# EAGLE design LEDControllerBoard (EAGLE 6.4)
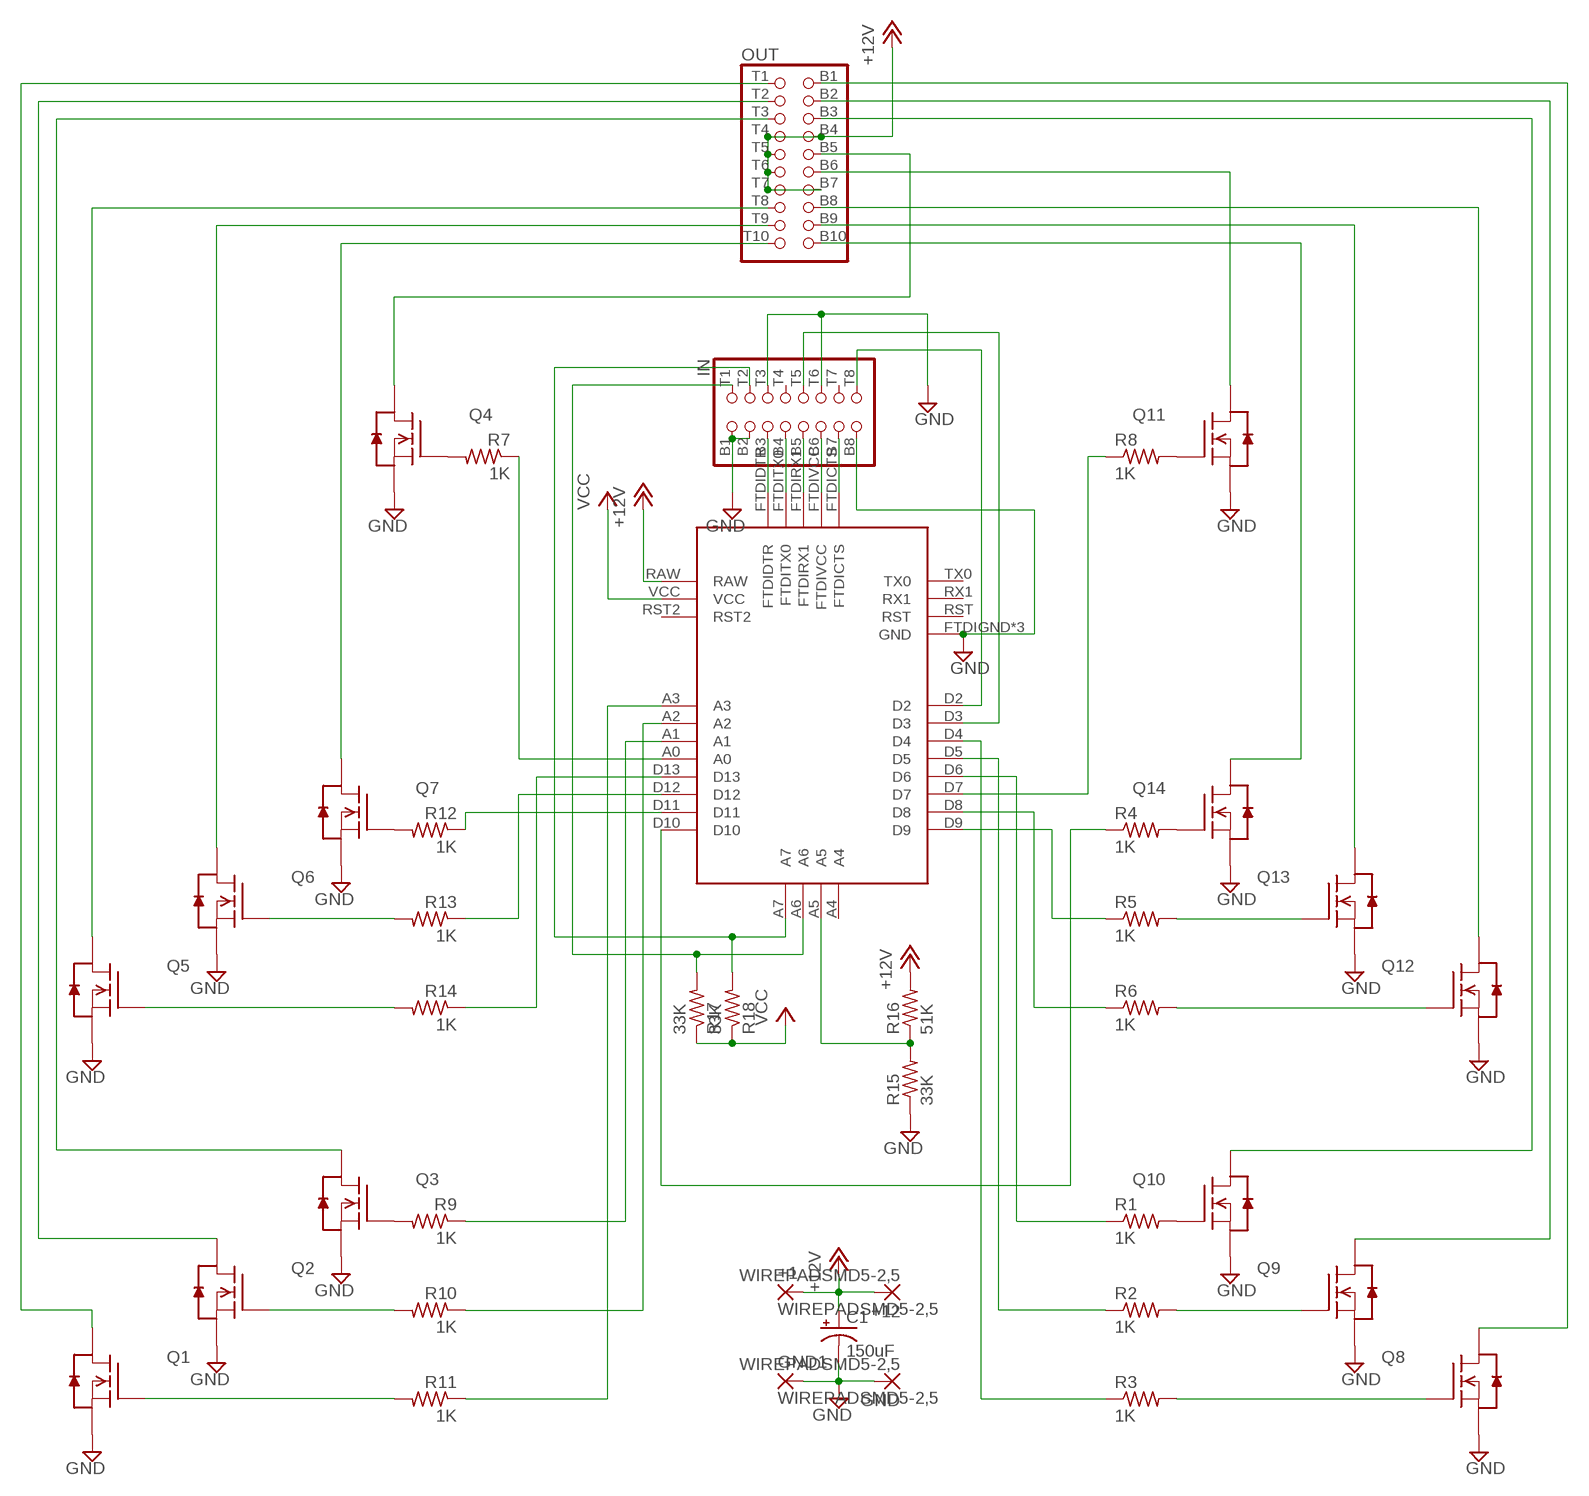
[diagram p0: schematic, sheet 1]

## Parts
+1  WIREPADSMD5-2,5  [5-2,5]
+12  WIREPADSMD5-2,5  [5-2,5]
C1  150uF  CPOL-USD  [PANASONIC_D]
GND  WIREPADSMD5-2,5  [5-2,5]
GND1  WIREPADSMD5-2,5  [5-2,5]
IN  PINHD-2X8/EDGE  [2X8/EDGE]
OUT  PINHD-2X10/EDGE  [2X10/EDGE]
Q1  FDC653NSSOT6  [SSOT6]
Q2  FDC653NSSOT6  [SSOT6]
Q3  FDC653NSSOT6  [SSOT6]
Q4  FDC653NSSOT6  [SSOT6]
Q5  FDC653NSSOT6  [SSOT6]
Q6  FDC653NSSOT6  [SSOT6]
Q7  FDC653NSSOT6  [SSOT6]
Q8  FDC653NSSOT6  [SSOT6]
Q9  FDC653NSSOT6  [SSOT6]
Q10  FDC653NSSOT6  [SSOT6]
Q11  FDC653NSSOT6  [SSOT6]
Q12  FDC653NSSOT6  [SSOT6]
Q13  FDC653NSSOT6  [SSOT6]
Q14  FDC653NSSOT6  [SSOT6]
R1  1K  R-US_R0603  [R0603]
R2  1K  R-US_R0603  [R0603]
R3  1K  R-US_R0603  [R0603]
R4  1K  R-US_R0603  [R0603]
R5  1K  R-US_R0603  [R0603]
R6  1K  R-US_R0603  [R0603]
R7  1K  R-US_R0603  [R0603]
R8  1K  R-US_R0603  [R0603]
R9  1K  R-US_R0603  [R0603]
R10  1K  R-US_R0603  [R0603]
R11  1K  R-US_R0603  [R0603]
R12  1K  R-US_R0603  [R0603]
R13  1K  R-US_R0603  [R0603]
R14  1K  R-US_R0603  [R0603]
R15  33K  R-US_R0603  [R0603]
R16  51K  R-US_R0603  [R0603]
R17  33K  R-US_R0603  [R0603]
R18  33K  R-US_R0603  [R0603]
U$15  ARDUINOPROMINI  [ARDUINOPROMINI]

## Nets
+12V: +1.1(P) +12.1(P) C1.+ OUT.B4 OUT.B7 OUT.T4 OUT.T5 OUT.T6 OUT.T7 R16.2 U$15.RAW
GND: C1.- GND1.1(P) GND.1(P) IN.B1 IN.B2 IN.B8 IN.T3 IN.T6 Q1.4(S) Q2.4(S) Q3.4(S) Q4.4(S) Q5.4(S) Q6.4(S) Q7.4(S) Q8.4(S) Q9.4(S) Q10.4(S) Q11.4(S) Q12.4(S) Q13.4(S) Q14.4(S) R15.1 U$15.FTDIGND(GND) U$15.GND U$15.GND2(GND)
N$1: Q10.3(G) R1.2
N$2: Q9.3(G) R2.2
N$3: OUT.B5 Q4.1(D) Q4.2(D) Q4.5(D) Q4.6(D)
N$4: OUT.B10 Q14.1(D) Q14.2(D) Q14.5(D) Q14.6(D)
N$5: Q8.3(G) R3.2
N$6: OUT.B9 Q13.1(D) Q13.2(D) Q13.5(D) Q13.6(D)
N$7: Q14.3(G) R4.2
N$8: Q13.3(G) R5.2
N$9: OUT.B8 Q12.1(D) Q12.2(D) Q12.5(D) Q12.6(D)
N$10: OUT.B3 Q10.1(D) Q10.2(D) Q10.5(D) Q10.6(D)
N$11: OUT.B2 Q9.1(D) Q9.2(D) Q9.5(D) Q9.6(D)
N$12: Q12.3(G) R6.2
N$13: OUT.B1 Q8.1(D) Q8.2(D) Q8.5(D) Q8.6(D)
N$14: OUT.B6 Q11.1(D) Q11.2(D) Q11.5(D) Q11.6(D)
N$15: R10.1 U$15.A2
N$16: OUT.T10 Q7.1(D) Q7.2(D) Q7.5(D) Q7.6(D)
N$17: OUT.T9 Q6.1(D) Q6.2(D) Q6.5(D) Q6.6(D)
N$18: Q3.3(G) R9.2
N$19: Q4.3(G) R7.2
N$20: Q11.3(G) R8.2
N$21: Q2.3(G) R10.2
N$22: OUT.T8 Q5.1(D) Q5.2(D) Q5.5(D) Q5.6(D)
N$23: OUT.T3 Q3.1(D) Q3.2(D) Q3.5(D) Q3.6(D)
N$24: Q1.3(G) R11.2
N$25: OUT.T2 Q2.1(D) Q2.2(D) Q2.5(D) Q2.6(D)
N$26: Q7.3(G) R12.2
N$27: Q6.3(G) R13.2
N$28: OUT.T1 Q1.1(D) Q1.2(D) Q1.5(D) Q1.6(D)
N$29: IN.B7 U$15.FTDICTS
N$30: Q5.3(G) R14.2
N$31: IN.B6 U$15.FTDIVCC
N$32: IN.B5 U$15.FTDIRX1
N$33: R3.1 U$15.D4
N$34: R2.1 U$15.D5
N$35: R1.1 U$15.D6
N$36: R6.1 U$15.D8
N$37: R5.1 U$15.D9
N$38: R4.1 U$15.D10
N$39: R7.1 U$15.A0
N$40: R8.1 U$15.D7
N$41: R15.2 R16.1 U$15.A5
N$42: IN.T5 U$15.D3
N$43: R9.1 U$15.A1
N$44: R11.1 U$15.A3
N$45: R12.1 U$15.D11
N$46: R14.1 U$15.D13
N$47: R13.1 U$15.D12
N$48: IN.T2 R18.2 U$15.A7
N$49: IN.T8 U$15.D2
N$50: IN.B4 U$15.FTDITX0
N$51: IN.B3 U$15.FTDIDTR
N$53: IN.T1 R17.2 U$15.A6
VCC: R17.1 R18.1 U$15.VCC
Unconnected: IN.T4 IN.T7 U$15.A4 U$15.RST U$15.RST2 U$15.RX1 U$15.TX0

## Library data of the parts
+1 +12 GND GND1 = wirepad:WIREPAD: Wire PAD connect wire on PCB
C1 = rcl:CPOL-US: POLARIZED CAPACITOR, American symbol
IN = clough:PINHD-2X8: PIN HEADER
OUT = clough:PINHD-2X10: PIN HEADER
Q1-Q14 = clough:FDC653N: Fairchild FDC653N N-Channel Enhancement Mode Field Effect Transistor
R1-R18 = resistor:R-US_: RESISTOR, American symbol
U$15 = clough:ARDUINOPROMINI: Arduino Pro Mini to be placed and soldered down as a daughter board.

## Net classes
1 +15V: width 0.61 mm, clearance 0.406 mm

## Board
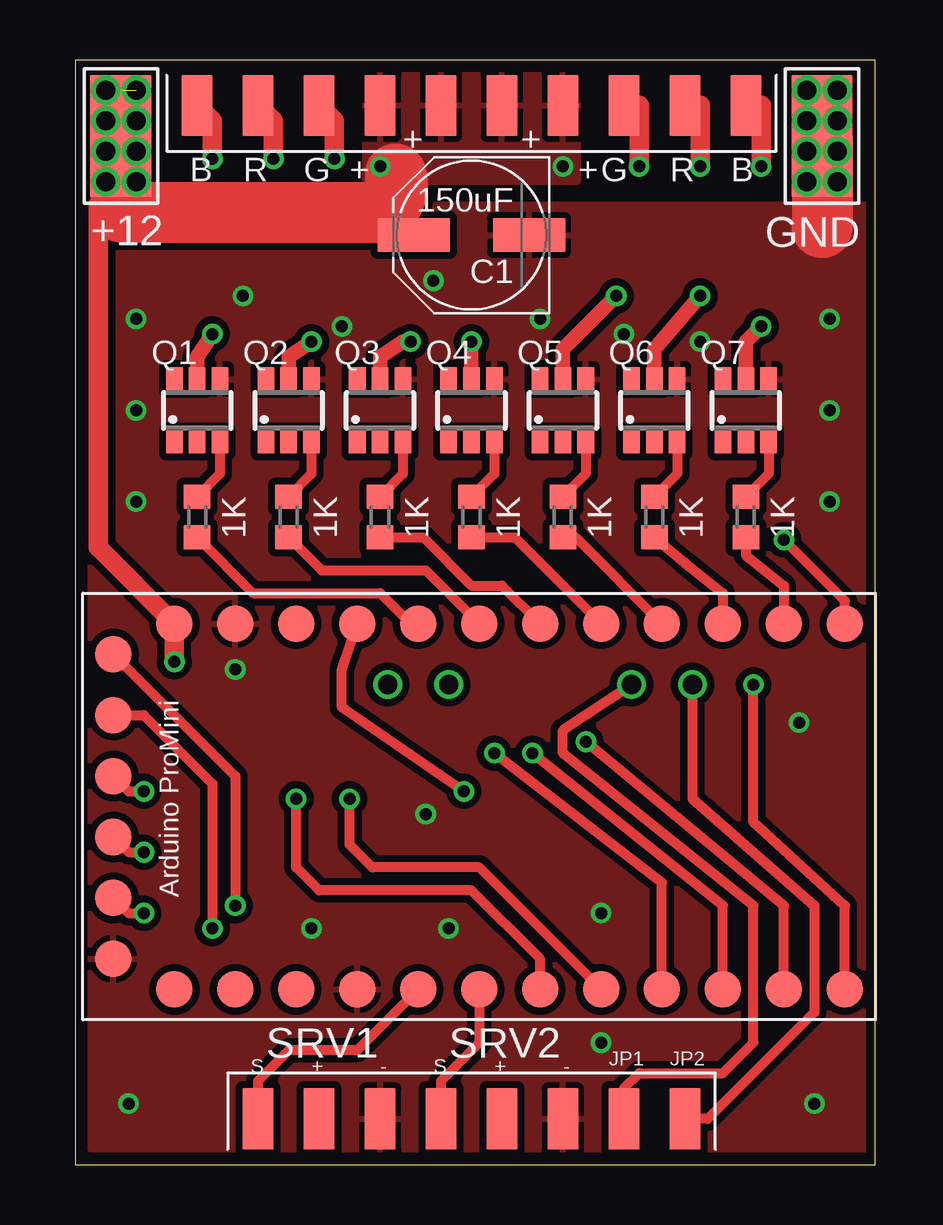
[diagram p1: board, top side]
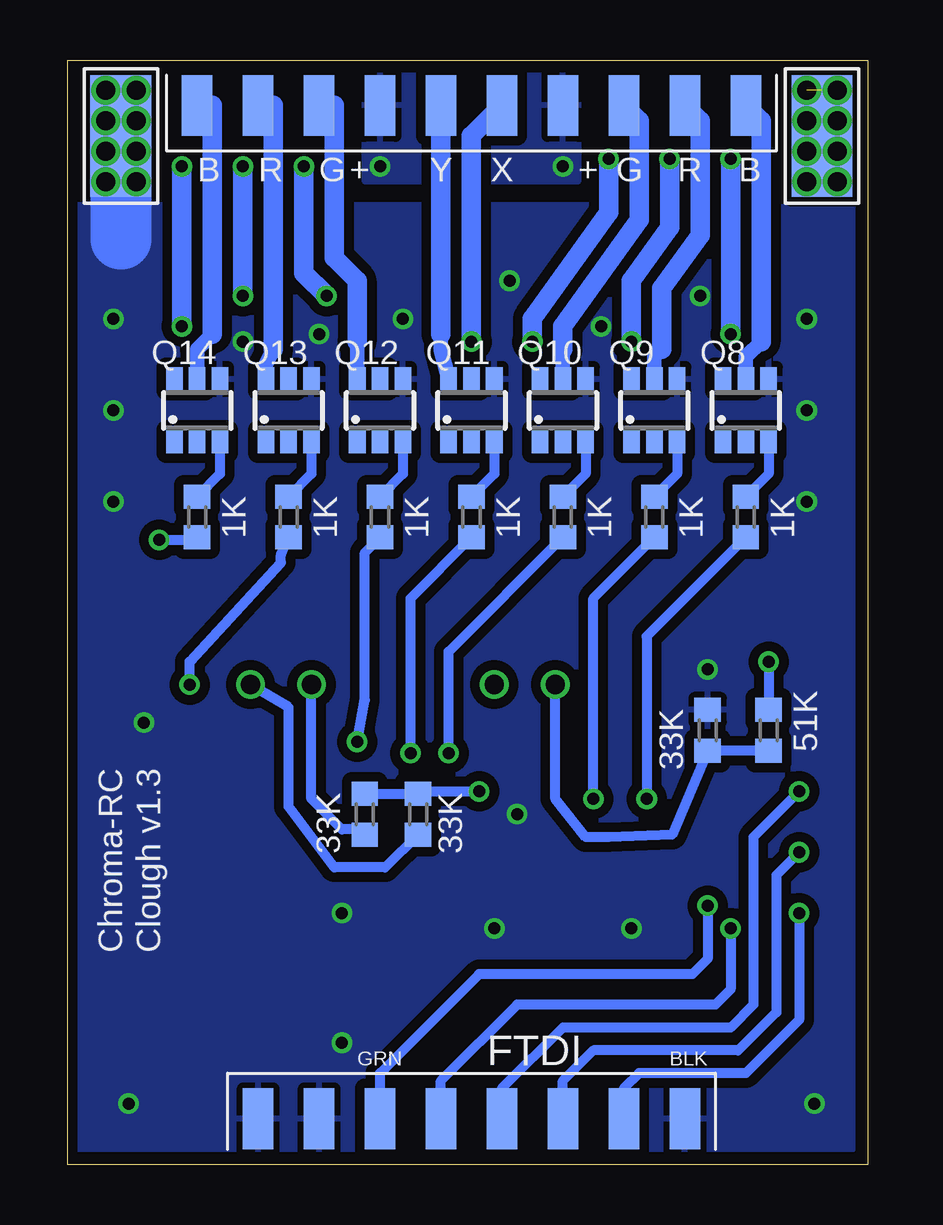
[diagram p2: board, bottom side, seen from below]

Size 33.32 x 46.03 mm. Coordinates in mm from the lower left corner, seen from the top.
Outline: 0,0 33.32,0 33.32,46.03 0,46.03 0,0
Copper layers (1*16): Top 0.0356mm / dielectric 1.5011mm / Bottom 0.0356mm
Design rules "LaenPCBOrder": minimum track width 6mil, minimum drill 13mil, track to track 6mil, track to pad 6mil, pad to pad 6mil, via to via 6mil, smd to smd 6mil, copper to edge 15mil, drill to drill 6mil, minimum pad ring 7mil, minimum via ring 7mil, stop-mask expansion 3mil, vias tented up to drill 0mil, thermal gap 10mil

### Footprints (pad centres in the part's own frame; a part is rotated, then mirrored left to right if it is on the bottom)
5-2,5 = smd 2.54 x 5.08: 1 0,0
PANASONIC_D = smd 3 x 1.4: + 2.4,0; - -2.4,0
2X8/EDGE = smd 1.27 x 2.54 bottom: B1 -8.89,0; B2 -6.35,0; B3 -3.81,0; B4 -1.27,0; B5 1.27,0; B6 3.81,0; B7 6.35,0; B8 8.89,0 | smd 1.27 x 2.54: T1 -8.89,0; T2 -6.35,0; T3 -3.81,0; T4 -1.27,0; T5 1.27,0; T6 3.81,0; T7 6.35,0; T8 8.89,0
2X10/EDGE = smd 1.27 x 2.54 bottom: B1 -11.43,0; B2 -8.89,0; B3 -6.35,0; B4 -3.81,0; B5 -1.27,0; B6 1.27,0; B7 3.81,0; B8 6.35,0; B9 8.89,0; B10 11.43,0 | smd 1.27 x 2.54: T1 -11.43,0; T2 -8.89,0; T3 -6.35,0; T4 -3.81,0; T5 -1.27,0; T6 1.27,0; T7 3.81,0; T8 6.35,0; T9 8.89,0; T10 11.43,0
SSOT6 = smd 0.69 x 0.99: 1 -0.95,-1.3; 2 0,-1.3; 3 0.95,-1.3; 4 0.95,1.3; 5 0,1.3; 6 -0.95,1.3
R0603 = smd 1 x 1.1: 1 -0.85,0; 2 0.85,0
ARDUINOPROMINI = smd 1.524 x 1.524: A0 7.62,-5.08; A1 7.62,-2.54; A2 7.62,0; A3 7.62,2.54; D2 -7.62,2.54; D3 -7.62,0; D4 -7.62,-2.54; D5 -7.62,-5.08; D6 -7.62,-7.62; D7 -7.62,-10.16; D8 -7.62,-12.7; D9 -7.62,-15.24; D10 7.62,-15.24; D11 7.62,-12.7; D12 7.62,-10.16; D13 7.62,-7.62; FTDICTS -3.81,15.24; FTDIDTR 6.35,15.24; FTDIGND -6.35,15.24; FTDIRX1 1.27,15.24; FTDITX0 3.81,15.24; FTDIVCC -1.27,15.24; GND -7.62,5.08; GND2 7.62,10.16; RAW 7.62,12.7; RST -7.62,7.62; RST2 7.62,7.62; RX1 -7.62,10.16; TX0 -7.62,12.7; VCC 7.62,5.08 | drill 0.8: A4 5.08,1.27; A5 5.08,3.81; A6 5.08,-8.89; A7 5.08,-6.35

### Placement (x,y rotation side)
+1  1.9,42.86 0 bottom
+12  1.9,42.86 180 top
C1  16.51,38.73 180 top
GND  31.11,42.86 180 top
GND1  31.11,42.86 180 bottom
IN  16.51,1.9 180 top
OUT  16.51,44.13 0 top
Q1  5.08,31.43 0 top
Q2  8.89,31.43 0 top
Q3  12.7,31.43 0 top
Q4  16.51,31.43 0 top
Q5  20.32,31.43 0 top
Q6  24.13,31.43 0 top
Q7  27.94,31.43 0 top
Q8  5.08,31.43 0 bottom
Q9  8.89,31.43 0 bottom
Q10  12.7,31.43 0 bottom
Q11  16.51,31.43 0 bottom
Q12  20.32,31.43 0 bottom
Q13  24.13,31.43 0 bottom
Q14  27.94,31.43 0 bottom
R1  12.7,26.99 90 bottom
R2  8.89,26.99 90 bottom
R3  5.08,26.99 90 bottom
R4  27.94,26.99 90 bottom
R5  24.13,26.99 90 bottom
R6  20.32,26.99 90 bottom
R7  16.51,26.99 90 top
R8  16.51,26.99 90 bottom
R9  12.7,26.99 90 top
R10  8.89,26.99 90 top
R11  5.08,26.99 90 top
R12  27.94,26.99 90 top
R13  24.13,26.99 90 top
R14  20.32,26.99 90 top
R15  6.67,18.1 270 bottom
R16  4.13,18.1 90 bottom
R17  18.73,14.61 270 bottom
R18  20.96,14.61 270 bottom
U$15  16.83,14.92 90 top

### Tracks (layer width: path | path; a pad name or v marks a point on that pad's centre or on a via)
+12V  (via drill 0.5, 0.8)  (1 unrouted)
  Top 0.406: +1.1 1.27,42.86 v1.27,43.5 v1.27,44.77 | v2.54,44.77 v2.54,43.5 v2.54,42.23 | v2.54,42.23 v2.54,40.96 | v2.54,42.23 v1.27,42.23 v1.27,40.96
  Top 0.813: 1.9,39.69 0.95,40.01 0.95,25.72 U$15.RAW v4.13,20.95
  Top 1.27: C1.+ 13.97,38.73 12.7,39.69
  Top 2.54: +1.1 1.9,39.69 12.7,39.69 arc90 13.34,41.28 13.34,40.96
  Bottom 0.406: v4.13,20.95 R16.2 | v1.27,44.77 1.9,44.77 +1.1
  other vias: 12.7,41.59 20.32,41.59
  pour Bottom (isolate 0.406): 12.07,45.4 12.07,40.96 20.96,40.96 20.96,45.4
  pour Top: 12.07,45.4 12.07,40.96 20.96,40.96 20.96,45.4
GND  (via drill 0.5, 0.8)
  Top 0.406: v30.48,44.77 31.11,44.77 GND1.1 | 31.75,42.86 30.48,42.86 v30.48,42.23 | 31.75,42.86 v31.75,42.23 v31.75,40.96 | v31.75,40.96 31.75,40.32 | v31.75,44.77 v30.48,44.77 | v31.75,43.5 31.75,42.86 | v31.75,40.96 v30.48,40.96 v30.48,42.23 | v30.48,42.23 v30.48,44.77
  Top 2.54: GND1.1 31.11,39.05
  Bottom 0.406: GND1.1 30.48,42.86 v30.48,43.5 v30.48,44.77
  Bottom 2.54: GND1.1 31.11,38.58
  other vias: 2.54,35.24 2.54,31.43 2.54,27.62 31.43,35.24 31.43,31.43 31.43,27.62 6.67,20.64 14.61,14.61 21.91,10.48 30.16,18.41 2.22,2.54 9.84,9.84 15.56,9.84 21.91,5.08 11.11,34.93 14.92,36.83 19.37,35.24 30.8,2.54 6.99,36.2 26.04,34.29 22.86,34.61
  pour Top (isolate 0.305): 33.02,40.01 0.64,40.01 0.64,0.63 33.02,0.63
  pour Bottom (isolate 0.406): 33.02,40.01 0.64,40.01 0.64,0.63 33.02,0.63
N$1
  Bottom 0.406: Q10.3 11.75,28.79 R1.2
N$2
  Bottom 0.406: Q9.3 7.94,28.79 R2.2
N$3  (via drill 0.5)
  Top 0.61: v16.51,34.29 Q4.5
  Bottom 0.813: OUT.B5 16.51,42.86 v16.51,34.29
N$4
  Bottom 0.61: 27.3,34.61 27.94,33.97 Q14.5
  Bottom 0.813: OUT.B10 27.3,44.13 27.3,34.61
N$5
  Bottom 0.406: Q8.3 4.13,28.79 R3.2
N$6
  Bottom 0.61: 24.77,33.97 25.08,33.34 Q13.6
  Bottom 0.813: OUT.B9 24.77,44.13 24.77,33.97
N$7
  Bottom 0.406: Q14.3 26.99,28.79 R4.2
N$8
  Bottom 0.406: Q13.3 23.18,28.79 R5.2
N$9
  Bottom 0.61: 21.27,34.96 21.27,34.29 Q12.6
  Bottom 0.813: OUT.B8 22.23,44.13 22.23,37.78 21.27,36.83 21.27,34.29
N$10
  Bottom 0.61: 12.7,33.97 Q10.5
  Bottom 0.813: OUT.B3 9.53,43.5 9.53,39.37 12.7,34.93 12.7,33.97
N$11
  Bottom 0.61: Q9.5 8.89,33.65 8.57,33.97
  Bottom 0.813: OUT.B2 6.99,43.5 6.99,38.73 8.57,36.51 8.57,33.97
N$12
  Bottom 0.406: Q12.3 19.37,28.79 R6.2
N$13
  Bottom 0.61: 4.45,34.29 5.08,33.65 Q8.5
  Bottom 0.813: OUT.B1 4.45,43.5 4.45,34.29
N$14
  Bottom 0.61: 17.78,34.61 17.78,33.97 Q11.6
  Bottom 0.813: OUT.B6 17.78,34.61
N$15
  Top 0.406: R10.1 10.26,24.76 14.61,24.76 U$15.A2
N$16  (via drill 0.5)
  Top 0.61: v28.57,34.93 27.94,34.29 Q7.5
  Top 0.813: OUT.T10 28.57,44.13 v28.57,41.59
  Bottom 0.813: v28.57,41.59 v28.57,34.93
N$17  (via drill 0.5)
  Top 0.61: v26.04,36.19 24.13,33.97 Q6.5
  Top 0.813: OUT.T9 26.04,44.13 v26.04,41.59
  Bottom 0.813: v26.04,41.59 v26.04,36.19
N$18
  Top 0.406: Q3.3 13.65,28.79 R9.2
N$19
  Top 0.406: Q4.3 17.46,28.79 R7.2
N$20
  Bottom 0.406: Q11.3 15.56,28.79 R8.2
N$21
  Top 0.406: Q2.3 9.84,28.79 R10.2
N$22  (via drill 0.5)
  Top 0.61: v22.54,36.19 20.32,33.97 Q5.5
  Top 0.813: v23.5,41.59 23.5,44.13 OUT.T8
  Bottom 0.813: v23.5,41.59 23.5,37.15 v22.54,36.19
N$23  (via drill 0.5)
  Top 0.61: v13.97,34.29 13.65,34.29 12.7,33.65 Q3.5
  Top 0.813: OUT.T3 10.79,43.5 v10.79,41.91
  Bottom 0.813: v10.79,41.91 10.79,39.69 13.97,35.24 v13.97,34.29
N$24
  Top 0.406: Q1.3 6.03,28.79 R11.2
N$25  (via drill 0.5)
  Top 0.61: v9.84,34.29 8.89,33.65 Q2.5
  Top 0.813: OUT.T2 8.26,43.5 v8.26,41.91
  Bottom 0.813: v8.26,41.91 8.26,39.05 9.84,36.83 v9.84,34.29
N$26
  Top 0.406: Q7.3 28.89,28.79 R12.2
N$27
  Top 0.406: Q6.3 25.08,28.79 R13.2
N$28  (via drill 0.5)
  Top 0.61: v5.71,34.61 5.08,33.65 Q1.5
  Top 0.813: OUT.T1 5.71,43.5 v5.71,41.91
  Bottom 0.813: v5.71,41.91 v5.71,34.61
N$29  (via drill 0.5)
  Top 0.406: U$15.FTDICTS 2.22,10.48 v2.86,10.48
  Bottom 0.406: v2.86,10.48 2.86,6.03 5.08,3.81 9.53,3.81 10.16,3.18 IN.B7
N$30
  Top 0.406: Q5.3 21.27,28.79 R14.2
N$31  (via drill 0.5)
  Top 0.406: U$15.FTDIVCC 2.22,13.02 v2.86,13.02
  Bottom 0.406: v2.86,13.02 3.81,12.06 3.81,6.35 5.4,4.76 11.43,4.76 12.7,3.49 IN.B6
N$32  (via drill 0.5)
  Top 0.406: U$15.FTDIRX1 2.22,15.56 v2.86,15.56
  Bottom 0.406: v2.86,15.56 4.76,13.65 4.76,6.67 5.71,5.71 12.7,5.71 15.24,3.18 IN.B5
N$33  (via drill 0.5)
  Top 0.406: U$15.D4 19.37,8.57 16.51,11.43 10.16,11.43 9.21,12.38 v9.21,15.24
  Bottom 0.406: v9.21,15.24 9.21,22.01 R3.1
N$34  (via drill 0.5)
  Top 0.406: U$15.D5 16.83,12.38 12.38,12.38 11.43,13.33 v11.43,15.24
  Bottom 0.406: v11.43,15.24 11.43,23.6 R2.1
N$35  (via drill 0.5)
  Top 0.406: U$15.D6 24.45,11.75 v17.46,17.15
  Bottom 0.406: v17.46,17.15 17.46,21.38 R1.1
N$36  (via drill 0.5 pad 0.41)
  Top 0.406: U$15.D8 29.53,10.79 v21.27,17.62
  Bottom 0.406: v21.27,17.62 20.96,19.37 20.96,25.5 R6.1
N$37  (via drill 0.5)
  Top 0.406: U$15.D9 32.07,10.79 28.26,14.29 v28.26,20
  Bottom 0.406: v28.26,20 28.26,20.95 24.45,25.08 24.45,25.4 R5.1
N$38  (via drill 0.5)
  Top 0.406: U$15.D10 32.07,23.49 v29.53,26.04
  Bottom 0.406: v29.53,26.04 28.04,26.04 R4.1
N$39
  Top 0.406: R7.1 18.31,26.14 U$15.A0
N$40  (via drill 0.5 pad 0.41)
  Top 0.406: U$15.D7 26.99,10.79 v19.05,17.15
  Bottom 0.406: v19.05,17.15 19.05,23.6 R8.1
N$41
  Bottom 0.406: R16.1 R15.2 8.15,13.76 10.79,13.65 11.75,13.65 13.02,15.24 U$15.A5
N$42
  Top 0.406: U$15.D3 16.83,5.08 15.24,3.49 IN.T5
N$43
  Top 0.406: R9.1 14.5,26.14 16.51,24.13 17.78,24.13 U$15.A1
N$44
  Top 0.406: R11.1 7.41,23.81 12.7,23.81 13.97,22.54 U$15.A3
N$45
  Top 0.406: R12.1 27.94,25.4 29.53,24.13 U$15.D11
N$46
  Top 0.406: R14.1 20.85,26.14 U$15.D13
N$47
  Top 0.406: R13.1 25.4,25.08 26.99,23.81 U$15.D12
N$48
  Top 0.406: IN.T2 22.86,3.18 23.5,3.81 26.99,3.81 28.26,5.08 28.26,10.79 20.32,17.15 20.32,18.1 U$15.A7
  Bottom 0.406: R18.2 21.17,13.97 21.91,13.97 23.18,15.24 U$15.A7
N$49
  Top 0.406: U$15.D2 11.75,4.76 8.89,4.76 7.62,3.49 IN.T8
N$50  (via drill 0.5)
  Top 0.406: U$15.FTDITX0 2.86,18.73 5.71,15.88 v5.71,9.84
  Bottom 0.406: v5.71,9.84 5.71,7.3 6.35,6.67 8.26,6.67 14.61,6.67 17.78,3.49 IN.B4
N$51  (via drill 0.5)
  Top 0.406: U$15.FTDIDTR 6.67,16.19 v6.67,10.79
  Bottom 0.406: v6.67,10.79 6.67,8.57 7.3,7.94 16.19,7.94 20.32,3.81 IN.B3
N$53
  Top 0.406: U$15.A6 25.72,15.24 30.8,10.79 30.8,6.35 26.35,1.9 IN.T1
  Bottom 0.406: R17.2 20.11,12.38 22.23,12.38 24.13,14.92 24.13,19.05 U$15.A6
VCC  (via drill 0.5)
  Top 0.406: v16.19,15.56 11.11,19.05 11.11,20.64 U$15.VCC
  Bottom 0.406: R18.1 R17.1 18.63,15.56 v16.19,15.56

### Text on the board
tNames: + | + | B | R | G | + | + | G | R | B | SRV1 | SRV2 | S | + | - | S | + | - | JP1 | JP2
bNames: B | R | G | + | X | Y | + | G | R | B | Clough v1.3 | Chroma-RC | BLK | FTDI | GRN
bValues: X | Y